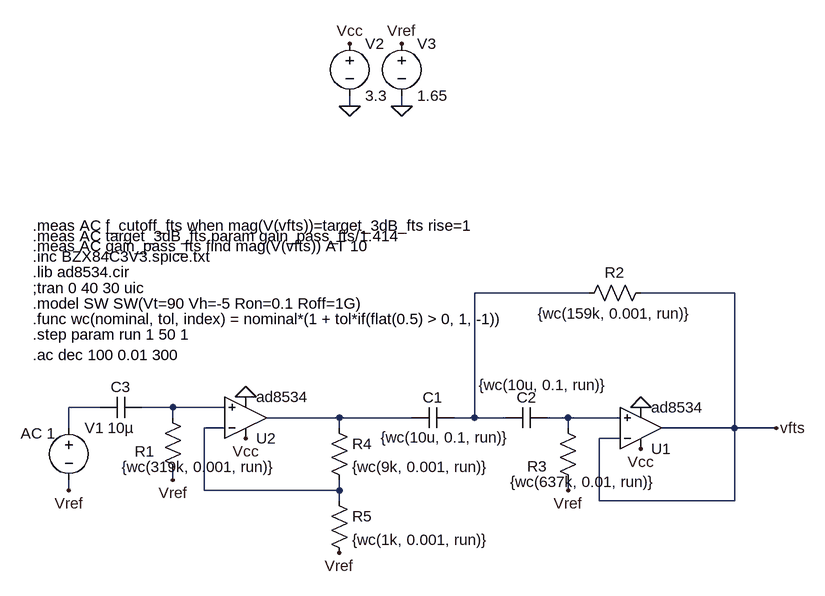
[diagram p0: schematic Toleranta FTS.asc]
Toleranta FTS.asc, the LTspice schematic file:
Version 4.1
SHEET 1 904 680
WIRE 80 -272 80 -288
WIRE 160 -272 160 -288
WIRE 448 16 272 16
WIRE 672 16 528 16
WIRE -304 192 -352 192
WIRE -192 192 -240 192
WIRE -112 192 -192 192
WIRE -192 208 -192 192
WIRE 64 208 -48 208
WIRE 176 208 64 208
WIRE 272 208 272 16
WIRE 272 208 240 208
WIRE 320 208 272 208
WIRE 416 208 384 208
WIRE 496 208 416 208
WIRE -352 224 -352 192
WIRE -112 224 -144 224
WIRE 64 224 64 208
WIRE 416 224 416 208
WIRE 672 224 672 16
WIRE 672 224 560 224
WIRE 736 224 672 224
WIRE 496 240 464 240
WIRE -192 304 -192 288
WIRE -352 320 -352 304
WIRE -144 320 -144 224
WIRE 64 320 64 304
WIRE 64 320 -144 320
WIRE 416 320 416 304
WIRE 64 336 64 320
WIRE 464 336 464 240
WIRE 672 336 672 224
WIRE 672 336 464 336
FLAG 416 320 Vref
FLAG 528 192 0
FLAG 528 256 Vcc
FLAG -192 304 Vref
FLAG -80 176 0
FLAG -80 240 Vcc
FLAG 736 224 vfts
FLAG 64 416 Vref
FLAG -352 320 Vref
FLAG 160 -272 0
FLAG 80 -272 0
FLAG 160 -368 Vref
FLAG 80 -368 Vcc
SYMBOL OpAmps\\opamp2 528 288 M180
SYMATTR InstName U1
SYMATTR Value ad8534
SYMBOL OpAmps\\opamp2 -80 272 M180
SYMATTR InstName U2
SYMATTR Value ad8534
SYMBOL res -208 192 R0
WINDOW 0 -43 68 Left 2
WINDOW 3 -63 92 Left 2
SYMATTR InstName R1
SYMATTR Value {wc(319k, 0.001, run)}
SYMBOL cap 240 192 R90
WINDOW 0 0 32 VBottom 2
WINDOW 3 31 13 VTop 2
SYMATTR InstName C1
SYMATTR Value {wc(10u, 0.1, run)}
SYMBOL cap 384 192 R90
WINDOW 0 0 32 VBottom 2
WINDOW 3 -50 6 VTop 2
SYMATTR InstName C2
SYMATTR Value {wc(10u, 0.1, run)}
SYMBOL res 544 0 R90
WINDOW 0 0 56 VBottom 2
WINDOW 3 32 56 VTop 2
SYMATTR InstName R2
SYMATTR Value {wc(159k, 0.001, run)}
SYMBOL res 400 208 R0
WINDOW 0 -47 75 Left 2
WINDOW 3 -73 99 Left 2
SYMATTR InstName R3
SYMATTR Value {wc(637k, 0.01, run)}
SYMBOL res 48 208 R0
SYMATTR InstName R4
SYMATTR Value {wc(9k, 0.001, run)}
SYMBOL res 48 320 R0
SYMATTR InstName R5
SYMATTR Value {wc(1k, 0.001, run)}
SYMBOL voltage -352 208 R0
WINDOW 123 -74 24 Left 2
WINDOW 39 0 0 Left 0
SYMATTR Value2 AC 1
SYMATTR InstName V1
SYMATTR Value ""
SYMBOL voltage 80 -384 R0
SYMATTR InstName V2
SYMATTR Value 3.3
SYMBOL voltage 160 -384 R0
SYMATTR InstName V3
SYMATTR Value 1.65
SYMBOL cap -240 176 R90
WINDOW 0 0 32 VBottom 2
WINDOW 3 32 32 VTop 2
SYMATTR InstName C3
SYMATTR Value 10µ
TEXT -408 -16 Left 2 !.lib ad8534.cir
TEXT -408 8 Left 2 !;tran 0 40 30 uic
TEXT -408 32 Left 2 !.model SW SW(Vt=90 Vh=-5 Ron=0.1 Roff=1G)
TEXT -408 -40 Left 2 !.inc BZX84C3V3.spice.txt
TEXT -408 56 Left 2 !.func wc(nominal, tol, index) = nominal*(1 + tol*if(flat(0.5) > 0, 1, -1))
TEXT -408 80 Left 2 !.step param run 1 50 1\n.ac dec 100 0.01 300
TEXT -408 -56 Left 2 !.meas AC gain_pass_fts find mag(V(vfts)) AT 10
TEXT -408 -72 Left 2 !.meas AC target_3dB_fts param gain_pass_fts/1.414
TEXT -408 -88 Left 2 !.meas AC f_cutoff_fts when mag(V(vfts))=target_3dB_fts rise=1

The netlist it stands for:
* Toleranta FTS.asc
X§U1 N005 vfts Vcc 0 vfts ad8534  ; pins In+ In- V+ V- OUT
X§U2 N003 N006 Vcc 0 N004 ad8534  ; pins In+ In- V+ V- OUT
R1 N003 Vref {wc(319k, 0.001, run)}
C1 N001 N004 {wc(10u, 0.1, run)}
C2 N005 N001 {wc(10u, 0.1, run)}
R2 vfts N001 {wc(159k, 0.001, run)}
R3 N005 Vref {wc(637k, 0.01, run)}
R4 N004 N006 {wc(9k, 0.001, run)}
R5 N006 Vref {wc(1k, 0.001, run)}
V1 N002 Vref AC 1
V2 Vcc 0 3.3
V3 Vref 0 1.65
C3 N003 N002 10µ
.lib ad8534.cir
;tran 0 40 30 uic
.model SW SW(Vt=90 Vh=-5 Ron=0.1 Roff=1G)
.inc BZX84C3V3.spice.txt
.func wc(nominal, tol, index) = nominal*(1 + tol*if(flat(0.5) > 0, 1, -1))
.step param run 1 50 1
.ac dec 100 0.01 300
.meas AC gain_pass_fts find mag(V(vfts)) AT 10
.meas AC target_3dB_fts param gain_pass_fts/1.414
.meas AC f_cutoff_fts when mag(V(vfts))=target_3dB_fts rise=1
.backanno
.end